# EAGLE design RC_car (EAGLE 9.6.2)
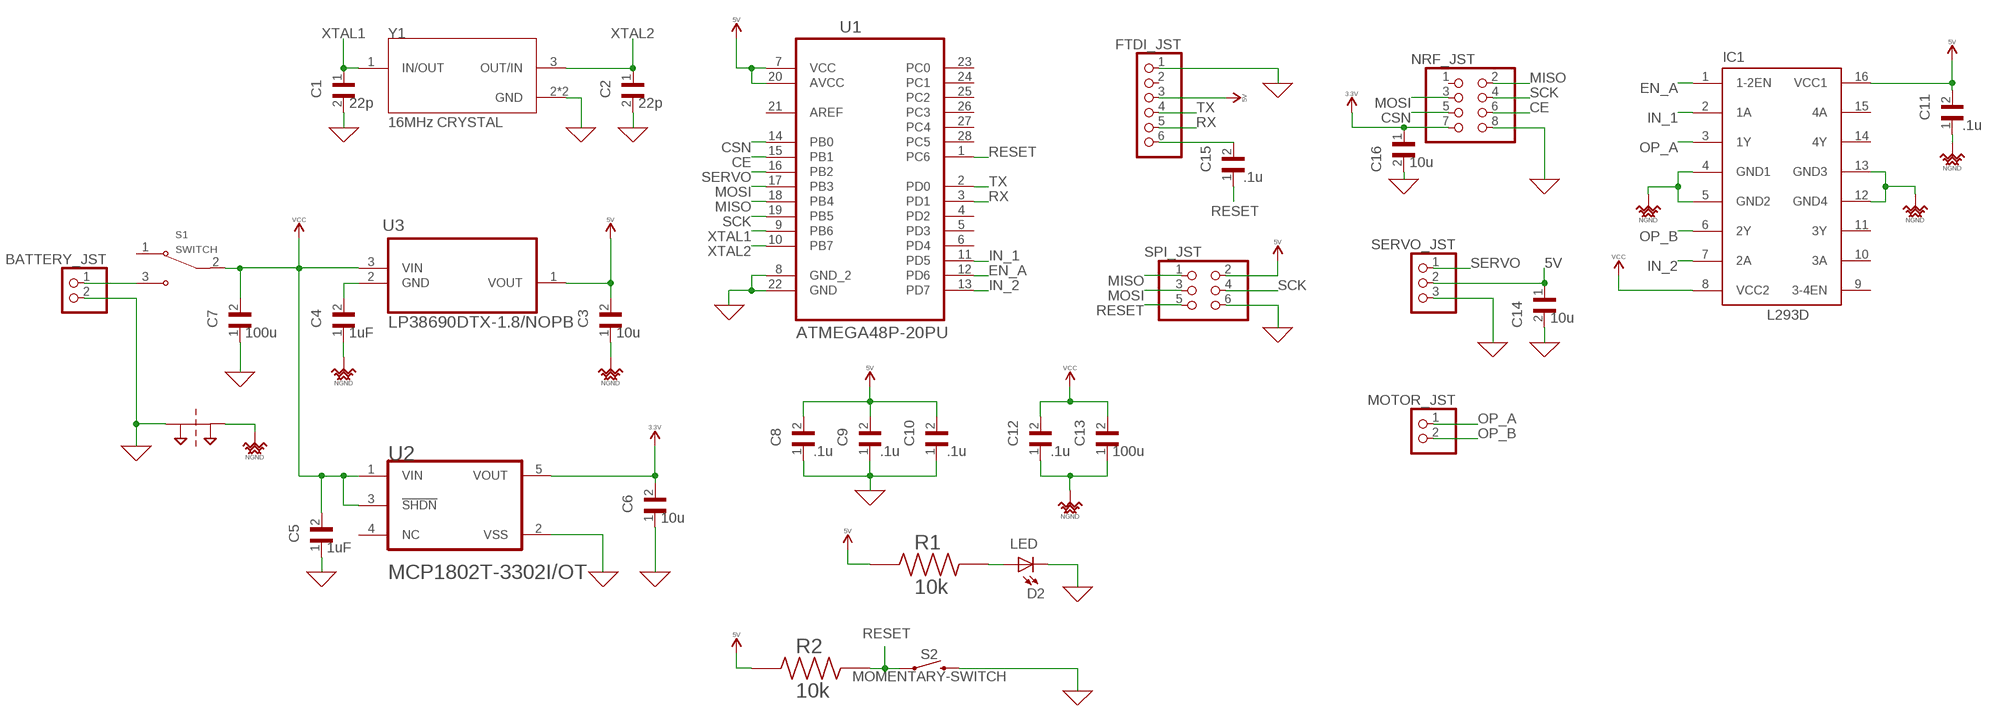
[diagram p0: schematic, sheet 1]

## Parts
BATTERY_JST  PINHD-1X2  [1X02]
C1  22p  C0805C220J5GACTU  [CAPC2012X140N]
C2  22p  C0805C220J5GACTU  [CAPC2012X140N]
C3  10u  EMK212ABJ106KD-T  [CAPC2013X95N]
C4  1uF  GRM216R61E105KA12D  [CAPC2012X70N]
C5  1uF  GRM216R61E105KA12D  [CAPC2012X70N]
C6  10u  EMK212ABJ106KD-T  [CAPC2013X95N]
C7  100u  LMK325ABJ107MM-P  [CAPC3225X280N]
C8  .1u  08055F104K4T2A  [CAPC2012X140N]
C9  .1u  08055F104K4T2A  [CAPC2012X140N]
C10  .1u  08055F104K4T2A  [CAPC2012X140N]
C11  .1u  08055F104K4T2A  [CAPC2012X140N]
C12  .1u  08055F104K4T2A  [CAPC2012X140N]
C13  100u  LMK325ABJ107MM-P  [CAPC3225X280N]
C14  10u  F381A106MMAAH1  [CAPC1608X90]
C15  .1u  08055F104K4T2A  [CAPC2012X140N]
C16  10u  F381A106MMAAH1  [CAPC1608X90]
D2  LED  LTST-C170TBKT  [DIOC200X125X110]
FTDI_JST  PINHD-1X6  [1X06]
IC1  L293D  [DIL16]
MOTOR_JST  PINHD-1X2  [1X02]
NET_BRIDGE1  NET_BRIDGE  [NET_BRIDGE]
NRF_JST  PINHD-2X4  [2X04]
R1  10k  CR0805-FX-1002ELF  [RESC2012X60N]
R2  10k  CR0805-FX-1002ELF  [RESC2012X60N]
S1  SWITCH  500SSP1S2M2QEA  [SW_500SSP1S2M2QEA]
S2  MOMENTARY-SWITCH  MOMENTARY-SWITCH-SPST-PTH-6.0MM  [TACTILE_SWITCH_PTH_6.0MM]
SERVO_JST  PINHD-1X3  [1X03]
SPI_JST  PINHD-2X3  [2X03]
U1  ATMEGA48P-20PU  [DIP254P762X457-28]
U2  MICROCHIP_MCP1802T-3302I-OTMICROCHIP_MCP1802T-3302I-OT_0_0  [MICROCHIP_MCP1802T-3302I-OT_0]
U3  LP38690DTX-1.8/NOPB  [TO228P1042X238-3N]
Y1  16MHz CRYSTAL  ECS-160-12-33-AGN-TR  [XTAL_ECS-160-12-33-AGN-TR]

## Nets
0: BATTERY_JST.2 C1.2 C2.2 C5.1 C6.1 C7.1 C8.1 C9.1 C10.1 C14.2 C16.2 D2.- FTDI_JST.1 NET_BRIDGE1.P$1 NRF_JST.8 S2.3 SERVO_JST.3 SPI_JST.6 U1.8(GND_2) U1.22(GND) U2.2(VSS) Y1.2(GND) Y1.4(GND) ; supply symbol labelled GND
3.3V: C6.2 C16.1 NRF_JST.7 U2.5(VOUT)
5V: C3.2 C8.2 C9.2 C10.2 C11.2 C14.1 FTDI_JST.3 IC1.16(VCC1) R1.1 R2.1 SERVO_JST.2 SPI_JST.2 U1.7(VCC) U1.20(AVCC) U3.1(VOUT)
CE: NRF_JST.6 U1.15(PB1)
CSN: NRF_JST.5 U1.14(PB0)
EN_A: IC1.1(1-2EN) U1.12(PD6)
IN_1: IC1.2(1A) U1.11(PD5)
IN_2: IC1.7(2A) U1.13(PD7)
MISO: NRF_JST.2 SPI_JST.1 U1.18(PB4)
MOSI: NRF_JST.3 SPI_JST.3 U1.17(PB3)
N$1: BATTERY_JST.1 S1.3(NO)
N$4: C4.2 U3.2(GND)
N$5: C15.2 FTDI_JST.6
N$9: D2.+ R1.2
NGND: C3.1 C4.1 C11.1 C12.1 C13.1 IC1.4(GND1) IC1.5(GND2) IC1.12(GND4) IC1.13(GND3) NET_BRIDGE1.P$2
OP_A: IC1.3(1Y) MOTOR_JST.1
OP_B: IC1.6(2Y) MOTOR_JST.2
RESET: C15.1 R2.2 S2.1 SPI_JST.5 U1.1(PC6)
RX: FTDI_JST.5 U1.3(PD1)
SCK: NRF_JST.4 SPI_JST.4 U1.19(PB5)
SERVO: SERVO_JST.1 U1.16(PB2)
TX: FTDI_JST.4 U1.2(PD0)
VCC: C5.2 C7.2 C12.2 C13.2 IC1.8(VCC2) S1.2(COM) U2.1(VIN) U2.3(!SHDN!) U3.3(VIN)
XTAL1: C1.1 U1.9(PB6) Y1.1(IN/OUT)
XTAL2: C2.1 U1.10(PB7) Y1.3(OUT/IN)
Unconnected: FTDI_JST.2 IC1.9(3-4EN) IC1.10(3A) IC1.11(3Y) IC1.14(4Y) IC1.15(4A) NRF_JST.1 S1.1(NC) U1.4(PD2) U1.5(PD3) U1.6(PD4) U1.21(AREF) U1.23(PC0) U1.24(PC1) U1.25(PC2) U1.26(PC3) U1.27(PC4) U1.28(PC5) U2.4(NC)

## Library data of the parts
BATTERY_JST MOTOR_JST = pinhead:PINHD-1X2: PIN HEADER
C1 C2 = C0805C220J5GACTU:C0805C220J5GACTU: SMD 0805 CERAMIC NPO -55^+125 22 PF +/-5? 50V; DESCRIPTION: 22 pF ±5% 50V Ceramic Capacitor C0G, NP0 0805 (2012 Metric); DIGI-KEY_PART_NUMBER: 399-C0805C220J5GAC7800CT-ND; MF: KEMET; MP: C0805C220J5GACTU; PACKAGE: 0805 Kemet; PURCHASE-URL: https://pricing.snapeda.com/search/part/C0805C220J5GACTU/?ref=eda
C3 C6 = EMK212ABJ106KD-T:EMK212ABJ106KD-T: Cap Ceramic 10uF 16V X5R 10% SMD 0805 85°C Paper T/R; DESCRIPTION: 10 µF ±10% 16V Ceramic Capacitor X5R 0805 (2012 Metric); DIGI-KEY_PART_NUMBER: 587-2980-1-ND; MF: Taiyo Yuden; MP: EMK212ABJ106KD-T; PACKAGE: 2012 Taiyo Yuden; PURCHASE-URL: https://pricing.snapeda.com/search/part/EMK212ABJ106KD-T/?ref=eda
C4 C5 = GRM216R61E105KA12D:GRM216R61E105KA12D: Cap Ceramic 1uF 25V X5R 10% Pad SMD 0805 85C T/R; DESCRIPTION: SMD Capacitor X5R(EIA) with Capacitance: 1.0uF Tol. 10%. Rated Voltage: 25Vdc; DIGI-KEY_PART_NUMBER: 490-1700-1-ND; MF: Murata; MP: GRM216R61E105KA12D; PACKAGE: 2012 Murata; PURCHASE-URL: https://pricing.snapeda.com/search/part/GRM216R61E105KA12D/?ref=eda
C7 C13 = LMK325ABJ107MM-P:LMK325ABJ107MM-P: Cap Ceramic 100uF 10V X5R 20% SMD 1210 85°C Embossed T/R; DESCRIPTION: 100 µF ±20% 10V Ceramic Capacitor X5R 1210 (3225 Metric); DIGI-KEY_PART_NUMBER: 587-4317-1-ND; MF: Taiyo Yuden; MP: LMK325ABJ107MM-P; PACKAGE: 3225 Taiyo Yuden; PURCHASE-URL: https://pricing.snapeda.com/search/part/LMK325ABJ107MM-P/?ref=eda
C8-C12 C15 = 08055F104K4T2A:08055F104K4T2A: 0805 100 nF 50 V ±10 % Tolerance X8R SMT Multilayer Ceramic Capacitor; DESCRIPTION: 0.1 µF ±10% 50V Ceramic Capacitor X8R 0805 (2012 Metric); DIGI-KEY_PART_NUMBER: 478-3614-1-ND; MF: AVX; MP: 08055F104K4T2A; PACKAGE: 2012 AVX; PURCHASE-URL: https://pricing.snapeda.com/search/part/08055F104K4T2A/?ref=eda
C14 C16 = F381A106MMAAH1:F381A106MMAAH1: Cap Tant Polymer 10uF 10VDC M CASE 20% (1.6 X 0.85 X 0.8mm) Undertab SMD 1608-09 0.3 Ohm 105C; DESCRIPTION: 10 µF Molded Tantalum Polymer Capacitor 10 V 0603 (1608 Metric) 300mOhm @ 100kHz; DIGI-KEY_PART_NUMBER: 478-9701-1-ND; MF: AVX; MP: F381A106MMAAH1; PACKAGE: 0603 AVX; PURCHASE-URL: https://pricing.snapeda.com/search/part/F381A106MMAAH1/?ref=eda
D2 = LTST-C170TBKT:LTST-C170TBKT: Green 2 x 1.25 x 1.1 mm 130° Water Clear 35 mcd 2 V Surface Mount LED; DESCRIPTION: LED Low-Power Uni-Color Blue 468nm 2-Pin Chip LED T/R; MF: Lite-On Electronics; MP: LTST-C170TBKT; PACKAGE: None; PURCHASE-URL: https://pricing.snapeda.com/search/part/LTST-C170TBKT/?ref=eda
FTDI_JST = pinhead:PINHD-1X6: PIN HEADER
IC1 = st-microelectronics:L293D: PUSH-PULL 4 CHANNEL DRIVER; MPN: L293D; OC_FARNELL: 9589619; OC_NEWARK: 56P8249
NET_BRIDGE1 = PiB_power_symbols:NET_BRIDGE
NRF_JST = pinhead:PINHD-2X4: PIN HEADER
R1 R2 = CR0805-FX-1002ELF:CR0805-FX-1002ELF: RESISITOR, 0805, 10KR, 1%; Power Rating:125mW; Resistance:10kohm; Resistance Tolerance:± 1%; Series:CR; Operating Temperature Range:-55°C to +155°C; Resistor Element Type:Thick Film; Voltage, Rating:100V; Temperature Coefficient:± 100ppm; Case Style:0805; DESCRIPTION: 10 kOhms ±1% 0.125W, 1/8W Chip Resistor 0805 (2012 Metric) Moisture Resistant Thick Film; DIGI-KEY_PART_NUMBER: CR0805-FX-1002ELFCT-ND; MF: Bourns; MP: CR0805-FX-1002ELF; PACKAGE: 2012 Bourns; PURCHASE-URL: https://pricing.snapeda.com/search/part/CR0805-FX-1002ELF/?ref=eda
S1 = Slide-Switch-500SSP1S2M2QEA:500SSP1S2M2QEA: Slide Switch SPDT Through Hole; DESCRIPTION: Slide Switch SPDT Through Hole; DIGI-KEY_PART_NUMBER: EG5137-ND; MF: E-Switch; MP: 500SSP1S2M2QEA; PACKAGE: None; PURCHASE-URL: https://pricing.snapeda.com/search/part/500SSP1S2M2QEA/?ref=eda
S2 = SparkFun-Switches:MOMENTARY-SWITCH-SPST: Momentary Switch (Pushbutton) - SPST Normally-open (NO) SPST momentary switches (buttons, pushbuttons). Variants PTH-12MM - 12mm square, through-hole Momentary Pushbutton Switch - 12mm Square <https://www.sparkfun.com/products/9190> (COM-09190) PTH-6.0MM, PTH-6.0MM-KIT - 6.0mm square, through-hole Mini Pushbutton Switch <https://www.sparkfun.com/products/97> (COM-00097) KIT package intended for soldering kit's - only one side of pads' copper is exposed. PTH-RIGHT-ANGLE-KIT - Right-angle, through-hole Right Angle Tactile Button <https://www.sparkfun.com/products/10791> - Used on SparkFun BigTime Watch Kit <https://www.sparkfun.com/products/11734> SMD-12MM - 12mm square, surface-mount Tactile Button - SMD (12mm) <https://www.sparkfun.com/products/12993> (COM-12993) Used on SparkFun PicoBoard <https://www.sparkfun.com/products/11888> SMD-4.5MM - 4.5mm Square Trackball Switch Used on SparkFun Blackberry Trackballer Breakout <https://www.sparkfun.com/products/13169> SMD-4.6MMX2.8MM - 4.60mm x 2.80mm, surface mount Used on SparkFun SAMD21 Mini Breakout <https://www.sparkfun.com/products/13664> SMD-5.2MM, SMD-5.2-REDUNDANT - 5.2mm square, surface-mount Mini Pushbutton Switch - SMD <https://www.sparkfun.com/products/8720> (COM-08720) Used on Arduino Pro Mini <https://www.sparkfun.com/products/11114> REDUNDANT package connects both switch circuits together SMD-6.0X3.5MM - 6.0 x 3.5mm, surface mount Momentary Reset Switch SMD <https://www.sparkfun.com/products/8229> (COM-08229) SMD-6.2MM-TALL - 6.2mm square, surface mount Tactile Button - SMD (6mm) <https://www.sparkfun.com/products/12992> Used on SparkFun Digital Sandbox <https://www.sparkfun.com/products/12651> SMD-RIGHT-ANGLE - Right-angle, surface mount Used on SparkFun Block for Intel® Edison - Arduino <https://www.sparkfun.com/products/13036>; PROD_ID: SWCH-08441; SF_SKU: COM-00097
SERVO_JST = pinhead:PINHD-1X3: PIN HEADER
SPI_JST = pinhead:PINHD-2X3: PIN HEADER
U1 = ATMEGA48P-20PU:ATMEGA48P-20PU: 8-bit Microcontroller with In-System Programmable Flash; DESCRIPTION: AVR AVR® ATmega Microcontroller IC 8-Bit 20MHz 4KB (2K x 16) FLASH 28-PDIP; DIGI-KEY_PART_NUMBER: ATMEGA48P-20PU-ND; MF: Microchip; MP: ATMEGA48P-20PU; PACKAGE: PDIP-28 Microchip; PURCHASE-URL: https://pricing.snapeda.com/search/part/ATMEGA48P-20PU/?ref=eda
U2 = OT:MICROCHIP_MCP1802T-3302I-OT: PM-LINEREG-MCP1802-IL5; ACCURACY_PERCENTAGE: 2%; AMBIENT_TEMPERATURE_RANGE_HIGH: +85°C; AMBIENT_TEMPERATURE_RANGE_LOW: -40°C; AUTOMOTIVE: No; CENTROID_NOT_SPECIFIED: No; CIIVA_IDS: 1493302; DATASHEET: http://ww1.microchip.com/downloads/en/DeviceDoc/22053C.pdf; DEVICE_CLASS_L1: Integrated Circuits (ICs); DEVICE_CLASS_L2: Power Management ICs; DEVICE_CLASS_L3: Voltage Regulators - Linear; DIGIKEY_DESCRIPTION: IC REG LINEAR 3.3V 300MA SOT23-5; DIGIKEY_PART_NUMBER: MCP1802T-3302I/OTCT-ND; DROPOUT_VOLTAGE: 240mV; FOOTPRINT_PARAMETERS_1: {"fp_type":"SOT23","params":{"N":{"default":"5","long name":"Number of leads","type":"multichoice","short name":"N"},"A":{"nom":1175000,"long name":"Height","min":900000,"max":1450000,"short name":"A","type":"measurement"},"A1":{"nom":false,"long name":"Package clearance","min":false,"max":150000,"short name":"A1","type":"measurement"},"A2":{"nom":1095000,"long name":"Package height","min":890000,"max":1300000,"short name":"A2","type":"measurement"},"D":{"nom":2900000,"long name":"Package length","min":2700000,"max":3100000,"short name":"D","type":"measurement"},"E":{"nom":2800000,"long name":"Width /w leads","min":false,"max":false,"short name":"E","type":"measurement"},"E1":{"nom":1600000,"long name":"Package width","min":1450000,"max":1750000,"short name":"E1","type":"measurement"},"B":{"nom":355000,"long name":"Lead width","min":200000,"max":510000,"short name":"B","type":"measurement"},"C":{"nom":170000,"long name":"Lead thickness","min":80000,"max":260000,"short name":"C","type":"measurement"},"L":{"nom":450000,"long name":"Lead foot length","min":300000,"max":600000,"short name":"L","type":"measurement"},"e":{"nom":950000,"long name":"Lead pitch","min":null,"max":null,"short name":"e","type":"measurement"},"PHI":{"nom":5,"long name":"Lead angle","min":0,"max":10,"short name":"PHI","type":"measurement"},"offset x":{"nom":0,"long name":"X Center offset","min":null,"max":null,"short name":"offset x","type":"measurement"},"offset y":{"nom":0,"long name":"Y Center offset","min":null,"max":null,"short name":"offset y","type":"measurement"},"LS":{"default":"Rounded rectangle","long name":"Land shape","type":"multichoice","short name":"LS"},"LS1":{"default":"Rectangle","long name":"Land shape (Pin 1)","type":"multichoice","short name":"LS1"},"solder toe":{"nom":550000,"long name":"Solder fillet (toe)","min":null,"max":null,"short name":"solder toe","type":"fixedmeasurement"},"solder heel":{"nom":450000,"long name":"Solder fillet (heel)","min":null,"max":null,"short name":"solder heel","type":"fixedmeasurement"},"solder side":{"nom":50000,"long name":"Solder fillet (side)","min":null,"max":null,"short name":"solder side","type":"fixedmeasurement"},"courtyard":{"nom":500000,"long name":"Courtyard","min":null,"max":null,"short name":"courtyard","type":"fixedmeasurement"},"SF":{"default":"A","long name":"Packing level","type":"multichoiceparent","short name":"SF","help":"http://support.upverter.com/customer/portal/articles/978783-what-is-a-footprint-packing-level","children":["solder toe","solder heel","solder side","courtyard"]}}}; FOOTPRINT_PARAMETERS_2: {"fp_type":"SOT23","params":{"N":{"default":"5","long name":"Number of leads","type":"multichoice","short name":"N"},"A":{"nom":1175000,"long name":"Height","min":900000,"max":1450000,"short name":"A","type":"measurement"},"A1":{"nom":false,"long name":"Package clearance","min":false,"max":150000,"short name":"A1","type":"measurement"},"A2":{"nom":1095000,"long name":"Package height","min":890000,"max":1300000,"short name":"A2","type":"measurement"},"D":{"nom":2900000,"long name":"Package length","min":2700000,"max":3100000,"short name":"D","type":"measurement"},"E":{"nom":2800000,"long name":"Width /w leads","min":false,"max":false,"short name":"E","type":"measurement"},"E1":{"nom":1600000,"long name":"Package width","min":1450000,"max":1750000,"short name":"E1","type":"measurement"},"B":{"nom":355000,"long name":"Lead width","min":200000,"max":510000,"short name":"B","type":"measurement"},"C":{"nom":170000,"long name":"Lead thickness","min":80000,"max":260000,"short name":"C","type":"measurement"},"L":{"nom":450000,"long name":"Lead foot length","min":300000,"max":600000,"short name":"L","type":"measurement"},"e":{"nom":950000,"long name":"Lead pitch","min":null,"max":null,"short name":"e","type":"measurement"},"PHI":{"nom":5,"long name":"Lead angle","min":0,"max":10,"short name":"PHI","type":"measurement"},"offset x":{"nom":0,"long name":"X Center offset","min":null,"max":null,"short name":"offset x","type":"measurement"},"offset y":{"nom":0,"long name":"Y Center offset","min":null,"max":null,"short name":"offset y","type":"measurement"},"LS":{"default":"Rounded rectangle","long name":"Land shape","type":"multichoice","short name":"LS"},"LS1":{"default":"Rectangle","long name":"Land shape (Pin 1)","type":"multichoice","short name":"LS1"},"solder toe":{"nom":350000,"long name":"Solder fillet (toe)","min":null,"max":null,"short name":"solder toe","type":"fixedmeasurement"},"solder heel":{"nom":350000,"long name":"Solder fillet (heel)","min":null,"max":null,"short name":"solder heel","type":"fixedmeasurement"},"solder side":{"nom":30000,"long name":"Solder fillet (side)","min":null,"max":null,"short name":"solder side","type":"fixedmeasurement"},"courtyard":{"nom":250000,"long name":"Courtyard","min":null,"max":null,"short name":"courtyard","type":"fixedmeasurement"},"SF":{"default":"B","long name":"Packing level","type":"multichoiceparent","short name":"SF","help":"http://support.upverter.com/customer/portal/articles/978783-what-is-a-footprint-packing-level","children":["solder toe","solder heel","solder side","courtyard"]}}}; FOOTPRINT_PARAMETERS_3: {"fp_type":"SOT23","params":{"N":{"default":"5","long name":"Number of leads","type":"multichoice","short name":"N"},"A":{"nom":1175000,"long name":"Height","min":900000,"max":1450000,"short name":"A","type":"measurement"},"A1":{"nom":false,"long name":"Package clearance","min":false,"max":150000,"short name":"A1","type":"measurement"},"A2":{"nom":1095000,"long name":"Package height","min":890000,"max":1300000,"short name":"A2","type":"measurement"},"D":{"nom":2900000,"long name":"Package length","min":2700000,"max":3100000,"short name":"D","type":"measurement"},"E":{"nom":2800000,"long name":"Width /w leads","min":false,"max":false,"short name":"E","type":"measurement"},"E1":{"nom":1600000,"long name":"Package width","min":1450000,"max":1750000,"short name":"E1","type":"measurement"},"B":{"nom":355000,"long name":"Lead width","min":200000,"max":510000,"short name":"B","type":"measurement"},"C":{"nom":170000,"long name":"Lead thickness","min":80000,"max":260000,"short name":"C","type":"measurement"},"L":{"nom":450000,"long name":"Lead foot length","min":300000,"max":600000,"short name":"L","type":"measurement"},"e":{"nom":950000,"long name":"Lead pitch","min":null,"max":null,"short name":"e","type":"measurement"},"PHI":{"nom":5,"long name":"Lead angle","min":0,"max":10,"short name":"PHI","type":"measurement"},"offset x":{"nom":0,"long name":"X Center offset","min":null,"max":null,"short name":"offset x","type":"measurement"},"offset y":{"nom":0,"long name":"Y Center offset","min":null,"max":null,"short name":"offset y","type":"measurement"},"LS":{"default":"Rounded rectangle","long name":"Land shape","type":"multichoice","short name":"LS"},"LS1":{"default":"Rectangle","long name":"Land shape (Pin 1)","type":"multichoice","short name":"LS1"},"solder toe":{"nom":150000,"long name":"Solder fillet (toe)","min":null,"max":null,"short name":"solder toe","type":"fixedmeasurement"},"solder heel":{"nom":250000,"long name":"Solder fillet (heel)","min":null,"max":null,"short name":"solder heel","type":"fixedmeasurement"},"solder side":{"nom":10000,"long name":"Solder fillet (side)","min":null,"max":null,"short name":"solder side","type":"fixedmeasurement"},"courtyard":{"nom":100000,"long name":"Courtyard","min":null,"max":null,"short name":"courtyard","type":"fixedmeasurement"},"SF":{"default":"C","long name":"Packing level","type":"multichoiceparent","short name":"SF","help":"http://support.upverter.com/customer/portal/articles/978783-what-is-a-footprint-packing-level","children":["solder toe","solder heel","solder side","courtyard"]}}}; FOOTPRINT_URL: http://ww1.microchip.com/downloads/en/DeviceDoc/05L_SOT-23_OT_C04-00091f.pdf; FOOTPRINT_VARIANT_NAME_0: Recommended_Land_Pattern; FOOTPRINT_VARIANT_NAME_1: IPC_A; FOOTPRINT_VARIANT_NAME_2: IPC_B; FOOTPRINT_VARIANT_NAME_3: IPC_C; HEIGHT: 1.45mm; IMPORTED_FROM: vault; IMPORT_TS: 1521858539; LEAD_FREE: Yes; MAX_POWER_DISSIPATION: 250mW; MAX_SUPPLY_VOLTAGE: 10V; MF: Microchip; MFG_PACKAGE_IDENT: C04-091-OT; MFG_PACKAGE_IDENT_COMPONENT_ID: 30338339b08beaef; MFG_PACKAGE_IDENT_DATE: 0; MFG_PACKAGE_IDENT_REV: F; MIN_SUPPLY_VOLTAGE: 2V; MOUSER_DESCRIPTION: LDO Voltage Regulators Hi PSRR 300 mA LDO Vin 10V maxVout 3.3V; MOUSER_PART_NUMBER: 579-MCP1802T-3302IOT; MPN: MCP1802T-3302I/OT; NOMINAL_SUPPLY_CURRENT: 25uA; NUMBER_OF_OUTPUTS: 1; OUTPUT_CURRENT: 300mA; OUTPUT_TYPE: Fixed; OUTPUT_VOLTAGE: 3.3V; PACKAGE: SOT-23-OT5; PREFIX: U; RELEASE_DATE: 1300337867; ROHS: Yes; TEMPERATURE_RANGE_HIGH: +85°C; TEMPERATURE_RANGE_LOW: -40°C; VAULT_GUID: 7CC48CEB-3BDC-4F71-BB9C-1D18D3193015; VERIFICATION_VERSION: 0.0.0.3
U3 = LP38690DTX-1.8_NOPB:LP38690DTX-1.8/NOPB: IC REG LDO 1A 5.0V Check prices <https://pricing.snapeda.com/parts/LP38690DTX-1.8/NOPB/Texas%20Instruments/view-part?ref=eda>; AVAILABILITY: In Stock; DESCRIPTION: 1-A, 10-V, low-dropout voltage regulator 3-TO-252 -40 to 125; MF: Texas Instruments; MP: LP38690DTX-1.8/NOPB; PACKAGE: TO-252-3 Texas Instruments; PRICE: None; PURCHASE-URL: https://pricing.snapeda.com/search/part/LP38690DTX-1.8/NOPB/?ref=eda
Y1 = Crystal-ECS-160-12-33-AGN-TR:ECS-160-12-33-AGN-TR; DESCRIPTION: 16 MHz ±25ppm Crystal 12pF 80 Ohms 4-SMD, No Lead; DIGI-KEY_PART_NUMBER: XC2930CT-ND; MF: ECS Inc.; MP: ECS-160-12-33-AGN-TR; PACKAGE: SMD-4 ECS International; PURCHASE-URL: https://pricing.snapeda.com/search/part/ECS-160-12-33-AGN-TR/?ref=eda

## Board
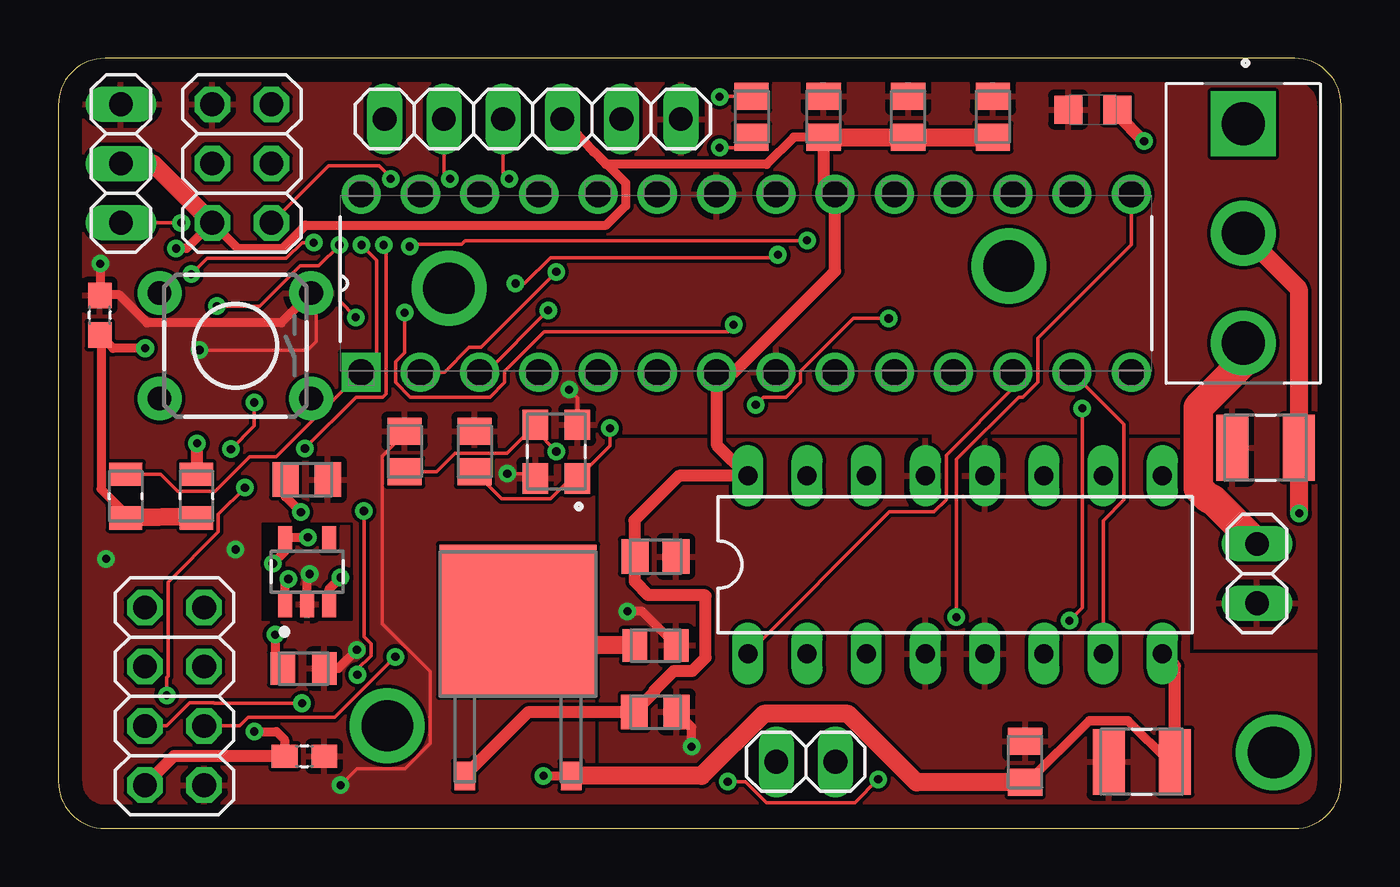
[diagram p1: board, top side]
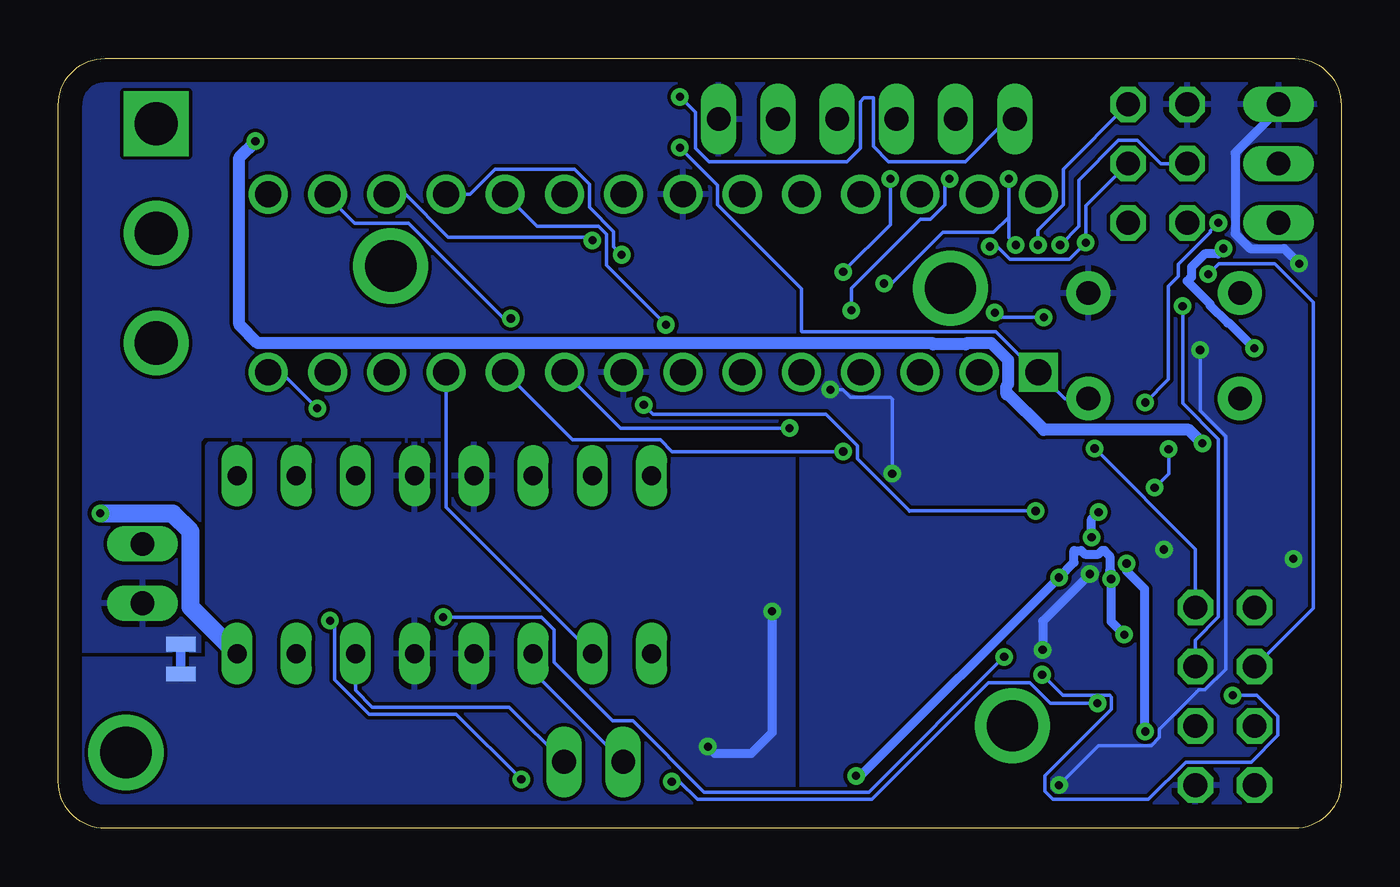
[diagram p2: board, bottom side, seen from below]

Size 55 x 33 mm. Coordinates in mm from the lower left corner, seen from the top.
Outline: 0,31 0,2 arc90 2,0 53,0 arc90 55,2 55,31 arc90 53,33 2,33 arc90 0,31
Copper layers (1*16): Top 0.035mm / dielectric 1.5mm / Bottom 0.035mm
Design rules "default": minimum track width 6mil, minimum drill 0.35mm, track to track 6mil, track to pad 6mil, pad to pad 6mil, via to via 6mil, smd to smd 6mil, copper to edge 40mil, drill to drill 6mil, minimum pad ring 10mil, minimum via ring 8mil, stop-mask expansion 4mil, vias tented up to drill 0mil, thermal gap 10mil

### Footprints (pad centres in the part's own frame; a part is rotated, then mirrored left to right if it is on the bottom)
1X02 = drill 1.016 long: 1 -1.27,0; 2 1.27,0
CAPC2012X140N = smd 1.16 x 1.47: 1 -0.875,0; 2 0.875,0
CAPC2013X95N = smd 1.12 x 1.48: 1 -0.907,0; 2 0.907,0
CAPC2012X70N = smd 1.05 x 1.38: 1 -0.888,0; 2 0.888,0
CAPC3225X280N = smd 1.37 x 2.81: 1 -1.42,0; 2 1.42,0
CAPC2012X140N' = smd 1.16 x 1.47: 1 -0.88,0; 2 0.88,0
CAPC1608X90 = smd 1.1 x 1: 1 -0.85,0; 2 0.85,0
DIOC200X125X110 = smd 1.2 x 1.2: + 1.05,0; - -1.05,0
1X06 = drill 1.016 long: 1 -6.35,0; 2 -3.81,0; 3 -1.27,0; 4 1.27,0; 5 3.81,0; 6 6.35,0
DIL16 = drill 0.813 long: 1 -8.89,-3.81; 2 -6.35,-3.81; 3 -3.81,-3.81; 4 -1.27,-3.81; 5 1.27,-3.81; 6 3.81,-3.81; 7 6.35,-3.81; 8 8.89,-3.81; 9 8.89,3.81; 10 6.35,3.81; 11 3.81,3.81; 12 1.27,3.81; 13 -1.27,3.81; 14 -3.81,3.81; 15 -6.35,3.81; 16 -8.89,3.81
NET_BRIDGE = smd 0.635 x 1.27: P$1 -0.635,0; P$2 0.635,0
2X04 = drill 1.016 octagon: 1 -3.81,-1.27; 2 -3.81,1.27; 3 -1.27,-1.27; 4 -1.27,1.27; 5 1.27,-1.27; 6 1.27,1.27; 7 3.81,-1.27; 8 3.81,1.27
RESC2012X60N = smd 1 x 1.42: 1 -0.935,0; 2 0.935,0
SW_500SSP1S2M2QEA = drill 1.85 square: 1 -4.7,0 | drill 1.85: 2 0,0; 3 4.7,0
TACTILE_SWITCH_PTH_6.0MM = drill 1.016 pad 1.88: 1 -3.251,2.261; 2 3.251,2.261; 3 -3.251,-2.261; 4 3.251,-2.261
1X03 = drill 1.016 long: 1 -2.54,0; 2 0,0; 3 2.54,0
2X03 = drill 1.016 octagon: 1 -2.54,-1.27; 2 -2.54,1.27; 3 0,-1.27; 4 0,1.27; 5 2.54,-1.27; 6 2.54,1.27
DIP254P762X457-28 = drill 1.118 square: 1 -7.62,33.02 | drill 1.118: 2 -7.62,30.48; 3 -7.62,27.94; 4 -7.62,25.4; 5 -7.62,22.86; 6 -7.62,20.32; 7 -7.62,17.78; 8 -7.62,15.24; 9 -7.62,12.7; 10 -7.62,10.16; 11 -7.62,7.62; 12 -7.62,5.08; 13 -7.62,2.54; 14 -7.62,0; 15 0,0; 16 0,2.54; 17 0,5.08; 18 0,7.62; 19 0,10.16; 20 0,12.7; 21 0,15.24; 22 0,17.78; 23 0,20.32; 24 0,22.86; 25 0,25.4; 26 0,27.94; 27 0,30.48; 28 0,33.02
MICROCHIP_MCP1802T-3302I-OT_0 = smd 1.1 x 0.6: 1 -1.4,0.95; 2 -1.4,0; 3 -1.4,-0.95; 4 1.4,-0.95; 5 1.4,0.95
TO228P1042X238-3N = smd 0.889 x 1.219: 1 -2.286,-6.502; 3 2.286,-6.502 | smd 6.731 x 6.502: 2 0,0.152
XTAL_ECS-160-12-33-AGN-TR = smd 1.3 x 1.1: 1 -1.15,-0.9; 2 1.15,-0.9; 3 1.15,0.9; 4 -1.15,0.9

### Placement (x,y rotation side)
BATTERY_JST  51.39,10.92 270 top
C1  17.85,16.15 90 top
C2  14.85,16.15 90 top
C3  25.6,4.99 180 top
C4  25.6,7.84 180 top
C5  10.51,6.85 180 top
C6  10.65,14.95 180 top
C7  51.76,16.31 0 top
C8  .1u  [CAPC2012X140N']  40.07,30.5 270 top
C9  .1u  [CAPC2012X140N']  36.44,30.5 270 top
C10  .1u  [CAPC2012X140N']  32.81,30.5 270 top
C11  .1u  [CAPC2012X140N']  25.6,11.65 180 top
C12  .1u  [CAPC2012X140N']  41.45,2.85 270 top
C13  46.45,2.85 0 top
C14  1.78,21.99 90 top
C15  .1u  [CAPC2012X140N']  29.72,30.49 90 top
C16  10.55,3.09 0 top
D2  44.35,30.8 0 top
FTDI_JST  20.34,30.4 180 top
IC1  38.45,11.3 0 top
MOTOR_JST  32.05,2.85 0 top
NET_BRIDGE1  49.75,7.25 270 bottom
NRF_JST  4.98,5.66 270 top
R1  5.92,14.24 90 top
R2  2.89,14.24 90 top
S1  50.8,25.5 270 top
S2  7.59,20.68 180 top
SERVO_JST  2.68,28.49 90 top
SPI_JST  7.87,28.49 90 top
U1  46,27.17 90 top
U2  10.67,11 90 top
U3  19.71,8.75 0 top
Y1  21.35,16.15 90 top

### Tracks (layer width: path | path; a pad name or v marks a point on that pad's centre or on a via)
0  (via drill 0.35)
  Top 0.152: C2.2 14.85,16.91 13.89,15.95 13.89,8.77 15.94,6.72 15.94,3.64 14.86,2.56 12.81,2.56 v12.1,1.85 | v6.05,20.5 10.7,20.5 11.05,20.85 11.05,22.73 S2.3 | Y1.4 20.25,15.2 v19.25,15.2 | v21.9,18.8 22.25,18.45 Y1.2
  Top 0.381: v1.8,24.2 1.8,22.86 | 1.8,22.86 C14.2 | U2.2 10.67,10.79 v10.78,10.9 | v12.8,7.65 12,6.85 C5.1 | 1.8,22.86 2.6,22.86 3.81,21.66 9.56,21.66 S2.3
  Bottom 0.152: v6.05,20.5 6.05,17.89 4.96,16.79 4.96,6.82 5.84,5.94 6.1,5.94 7.79,4.25 7.79,3.9 8.15,3.54 10.41,3.54 v12.1,1.85 | v19.25,15.2 19.25,18.4 19.33,18.48 21.04,18.48 21.36,18.8 v21.9,18.8
  Bottom 0.381: v1.8,24.2 2.44,24.84 3.9,24.84 4.55,25.49 4.55,28.95 2.68,30.82 SERVO_JST.3 | v10.78,10.9 12.8,8.88 v12.8,7.65
  other vias: 2.05,11.55 7.6,11.95
  pour Bottom (rank 6): 0.05,-0.2 54.55,-0.2 54.95,0.2 54.95,33 54.8,33.15 0.2,33.15 -0.35,32.6 -0.35,0.35 0,0 -0.15,0
  pour Top (rank 6): -0.2,-0.05 54.3,-0.05 54.7,0.35 54.7,33.15 54.55,33.3 -0.05,33.3 -0.6,32.75 -0.6,0.5 -0.25,0.15 -0.4,0.15
3.3V  (via drill 0.35)
  Top 0.381: v10.7,12.47 9.79,12.47 U2.5 9.72,11.87 v9.2,11.35 | v10.4,13.55 9.74,14.21 C6.2 | v8.4,4.15 9.35,4.15 9.7,3.8 C16.1
  Top 0.508: C16.1 4.95,3.09 NRF_JST.7
  Bottom 0.381: v10.7,12.47 10.7,13.25 v10.4,13.55 | v9.2,11.35 9.2,11.04 8.43,10.26 8.43,4.18 v8.4,4.15
5V  (via drill 0.35)
  Top 0.381: C10.2 31.53,29.62 30.36,28.45 23.48,28.45 FTDI_JST.3 22.94,28.99 22.99,28.99 24.32,27.66 24.32,26.68 23.49,25.85 10.6,25.85 9.6,24.84 7.71,24.84 SPI_JST.2 5.5,24.85 v5.05,24.85 | v3.73,20.57 2.35,20.57 C14.1 1.84,21.08 1.84,14.53 2.89,13.48 R2.1
  Top 0.508: C10.2 32.81,27.66 U1.20 33.3,23.88 28.97,19.55 U1.7 28.22,16.45 IC1.16 26.61,15.11 24.7,13.2 24.7,11.67 C11.2 24.72,10.58 25.3,10 27.7,10 27.75,9.95 27.75,7.31 27.18,6.74 26.39,6.74 25.54,5.9 25.54,5.84 C3.2 20.17,4.99 U3.1
  Top 0.762: R1.1 5.87,13.36 R2.1 | C10.2 C9.2 C8.2 | SERVO_JST.2 4.06,28.49 SPI_JST.2
  Bottom 0.381: v5.05,24.85 5.28,24.62 5.85,24.62 6.42,24.05 6.42,23.63 6.6,23.45 5.62,22.47 5.62,22.41 4.87,21.66 4.81,21.66 v3.73,20.57
CE  (via drill 0.35)
  Top 0.152: NRF_JST.6 7.78,4.39 8.15,4.76 11.86,4.76 v14.45,7.35 | v38.5,9.05 38.5,15.81 41.18,18.48 41.36,18.48 41.99,19.11 41.99,21.01 46,25.02 U1.15
  Bottom 0.152: v14.45,7.35 20.25,1.55 27.32,1.55 30.37,4.6 31.23,4.6 33.75,7.12 33.75,8.52 34.27,9.04 38.49,9.04 v38.5,9.05
CSN  (via drill 0.35)
  Top 0.152: NRF_JST.5 4.64,4.39 5.63,5.38 6.66,5.38 6.68,5.36 v10.45,5.36 | v28.7,2 29.47,2 30.37,1.1 34.15,1.1 v35.15,2.1 | v43.35,8.9 43.9,9.45 v43.9,18
  Bottom 0.152: v10.45,5.36 12.47,5.36 13.34,6.24 15.13,6.24 20.12,1.25 27.61,1.25 28.36,2 v28.7,2 | v35.15,2.1 37.95,4.89 41.68,4.89 43.15,6.37 43.15,8.7 v43.35,8.9 | v43.9,18 45.45,19.55 U1.14
EN_A
  Top 0.152: U1.12 40.92,18.85 38.07,16 38.07,14.08 37.55,13.56 35.63,13.56 IC1.1
IN_1
  Bottom 0.152: IC1.2 38.38,13.77 U1.11
IN_2
  Top 0.152: IC1.7 44.8,13.19 45.69,14.08 45.69,17.32 U1.13
MISO  (via drill 0.35)
  Top 0.152: SPI_JST.1 11.59,28.4 13.75,28.4 14.25,27.9 v14.25,27.84 | v13.95,25 14,25 14.05,24.84 14.05,18.62 13.91,18.48 12.77,18.48 v10.57,16.28 | v19.6,23.35 19.99,23.35 21.1,24.46 30.73,24.46 v30.85,24.58
  Bottom 0.152: v14.25,27.84 14.25,26.2 | 14.25,26.2 14.25,25.3 v13.95,25 | v10.57,16.28 6.25,11.96 NRF_JST.2 | 14.25,26.2 14.91,25.54 17.07,25.54 19.26,23.35 v19.6,23.35 | v30.85,24.58 31.19,24.92 31.19,25.58 32.23,26.62 32.23,27.61 32.86,28.24 36.28,28.24 37.35,27.17 U1.18
MOSI  (via drill 0.35)
  Top 0.152: v10.95,25.1 10.45,25.1 9.77,24.43 6.38,24.43 v5.7,23.75 | v15.07,24.93 15.17,25.03 17.29,25.03 17.44,25.19 32.09,25.19 v32.1,25.2
  Bottom 0.152: NRF_JST.3 1.2,9.44 1.2,22.55 2.85,24.2 5.25,24.2 v5.7,23.75 | SPI_JST.3 10.95,26.68 v10.95,25.1 11.66,24.39 14.2,24.39 14.74,24.93 v15.07,24.93 | v32.1,25.2 32.24,25.34 38.29,25.34 40.12,27.17 U1.17
N$1
  Top 1.27: S1.3 50.8,19.97 48.87,18.04 48.87,14.58 49.33,14.12 49.46,14.12 BATTERY_JST.1
N$2  (via drill 2.2)
  other vias: 14.1,4.4
N$3  (via drill 2.2)
  other vias: 16.75,23.15
N$4
  Top 0.152: U3.2 20,8.9 20.2,8.7
  Top 0.762: C4.2 21.06,7.84 20.2,8.7
N$5  (via drill 0.35)
  Top 0.152: v28.35,31.35 28.37,31.37 C15.2
  Bottom 0.152: v28.35,31.35 27.68,30.68 27.68,29.15 27.1,28.57 21.2,28.57 20.62,29.15 20.62,31.13 20.45,31.3 20.06,31.3 20.06,29.23 19.41,28.57 16.11,28.57 14.37,30.32 FTDI_JST.6
N$7  (via drill 2.2)
  other vias: 40.75,24.1
N$8  (via drill 2.2)
  other vias: 52.1,3.25
N$9  (via drill 0.35)
  Top 0.508: R1.2 5.95,15.21 v5.95,16.5 | v46.55,29.45 45.4,30.6 D2.+
  Bottom 0.508: v5.95,16.5 6.52,17.07 12.75,17.07 14.28,18.6 14.35,18.6 14.35,18.96 14.28,19.03 14.28,20.07 15,20.8 16.04,20.8 16.09,20.74 17.49,20.74 17.54,20.8 46.45,20.8 47.24,21.59 47.24,28.75 v46.55,29.45
NGND  (via drill 0.35)
  Top 0.381: C4.1 25.03,9.3 v24.4,9.3 | v27.15,3.5 27.15,4.35 C3.1
  Bottom 0.381: v24.4,9.3 24.4,4.1 25.3,3.2 26.85,3.2 v27.15,3.5
  pour Bottom (rank 5): 24.2,-0.6 55.6,-0.6 55.75,-0.75 55.75,7.3 48.7,7.3 48.65,7.35 48.65,16.4 48.55,16.5 23.5,16.5 23.45,16.45 23.45,0.05 24.15,-0.65
  pour Top (rank 5): 24,-0.45 55.4,-0.45 55.55,-0.6 55.55,7.45 48.5,7.45 48.45,7.5 48.45,16.55 48.35,16.65 23.3,16.65 23.25,16.6 23.25,0.2 23.95,-0.5
OP_A
  Bottom 0.152: MOTOR_JST.1 34.64,6.71 IC1.3
OP_B
  Bottom 0.152: MOTOR_JST.2 35.67,5.2 41.55,5.2 42.26,5.91 IC1.6
RESET  (via drill 0.35)
  Top 0.152: C15.1 29.28,29.17 v28.35,29.17 | R2.2 4.39,15.18 5.12,14.45 6.72,14.45 8.2,15.92 9.35,15.92 U1.1 13.65,20.22 13.65,24.35 v13,25
  Bottom 0.152: v28.35,29.17 26.75,27.57 26.75,26.73 23.15,23.13 23.15,21.3 23.13,21.28 14.8,21.28 13.08,19.55 U1.1 11.85,18.42 S2.1 | SPI_JST.5 11.91,28.26 11.91,26.73 13,25.64 v13,25
RX  (via drill 0.35)
  Top 0.152: FTDI_JST.5 16.53,28.1 v16.79,27.84 | v21,22.2 18.35,19.55 U1.3
  Bottom 0.152: v16.79,27.84 16.99,27.63 16.99,26.73 17.62,26.1 18.04,26.1 21,23.15 v21,22.2
SCK  (via drill 0.35)
  Top 0.152: v6.8,22.38 8.63,22.38 10.36,24.11 11.16,24.11 v12.05,25 12.05,22.6 v12.75,21.9 | v14.85,22.1 14.85,20.39 14.45,19.99 14.45,19.11 15.08,18.48 18.5,18.48 19.13,19.11 19.13,19.59 20.82,21.28 28.7,21.28 28.95,21.53 v28.95,21.58
  Bottom 0.152: v12.05,25 11.26,25.8 11.26,27.78 9.55,29.48 8.73,29.48 7.74,28.49 SPI_JST.4 | v6.8,22.38 6.8,18.21 5.26,16.67 5.26,9.06 6.25,8.07 NRF_JST.4 | v12.75,21.9 14.65,21.9 v14.85,22.1 | U1.19 34.48,25.81 31.85,25.81 31.49,25.45 31.49,24.12 v28.95,21.58
SERVO  (via drill 0.35)
  Top 0.152: SERVO_JST.1 v5.27,25.95 | v8.4,18.25 8.4,17.25 v7.4,16.25 | v8,14.6 6.86,13.46 6.86,12.71 4.7,10.55 4.7,6.52 4.65,6.47 v4.65,5.7 | v12.82,6.58 12.82,6.81 13.41,7.4 13.41,7.9 13.1,8.21 v13.1,13.6 | v29.9,18.15 30.23,18.48 31.2,18.48 31.83,19.11 31.83,19.59 34.09,21.85 v35.6,21.85
  Bottom 0.152: v5.27,25.95 5.61,25.61 5.61,25.54 6.97,24.18 6.97,23.67 7.41,23.24 7.41,19.24 v8.4,18.25 | U1.16 43.49,27.14 42.29,25.94 39.99,25.94 35.9,21.85 v35.6,21.85 | v7.4,16.25 7.4,15.2 v8,14.6 | v12.82,6.58 11.94,5.7 9.93,5.7 9.84,5.62 9.84,5.11 12.71,2.25 12.71,1.6 12.35,1.24 8.26,1.24 6.66,2.84 3.86,2.84 2.72,3.98 2.72,4.8 3.62,5.7 v4.65,5.7 | v29.9,18.15 29.51,17.76 22.1,17.76 20.74,16.4 20.74,15.84 18.51,13.6 v13.1,13.6
TX  (via drill 0.35)
  Top 0.152: FTDI_JST.4 19.07,28.1 v19.33,27.84 | v21.35,23.85 18.12,20.62 17.62,20.62 16.55,19.55 U1.2
  Bottom 0.152: v19.33,27.84 19.33,25.87 v21.35,23.85
VCC  (via drill 0.35)
  Top 0.381: U2.1 9.72,10.54 v9.87,10.68 | v9.3,8.3 9.3,7.17 C5.2 | U2.3 11.62,10.27 v12.1,10.75 | v20.8,2.25 U3.3
  Top 0.406: C12.2 41.56,1.97 44.2,4.61 45.86,4.61 47.62,2.85 C13.2
  Top 0.508: C13.2 47.87,6.96 IC1.8
  Top 0.762: S1.2 53.18,23.12 C7.2 53.2,16.29 v53.2,13.5 | C12.2 36.79,1.97 33.86,4.91 30.24,4.91 27.58,2.25 U3.3
  Bottom 0.381: v9.3,8.3 9.87,8.87 v9.87,10.68 9.87,11 9.92,11.05 9.92,11.67 10.15,11.9 10.25,11.9 10.4,11.75 11,11.75 11.15,11.9 11.45,11.9 11.45,11.4 v12.1,10.75 20.6,2.25 v20.8,2.25
  Bottom 0.762: IC1.8 49.33,9.48 49.33,12.73 50.09,13.48 53.19,13.48 v53.2,13.5
XTAL1  (via drill 0.35)
  Top 0.152: v23.65,17.15 23.65,16.4 Y1.1 21.97,15 21.09,14.12 19,14.12 C1.1
  Bottom 0.152: U1.9 30.9,17.15 v23.65,17.15
XTAL2  (via drill 0.35)
  Top 0.152: v21.35,16.15 20.45,17.05 Y1.3 19.23,16.08 17.02,16.08 16.21,15.28 C2.1
  Bottom 0.152: v21.35,16.15 28.68,16.15 29.19,16.66 32.95,16.66 U1.10